# Altium project XVF3000_core_board.PrjPCB
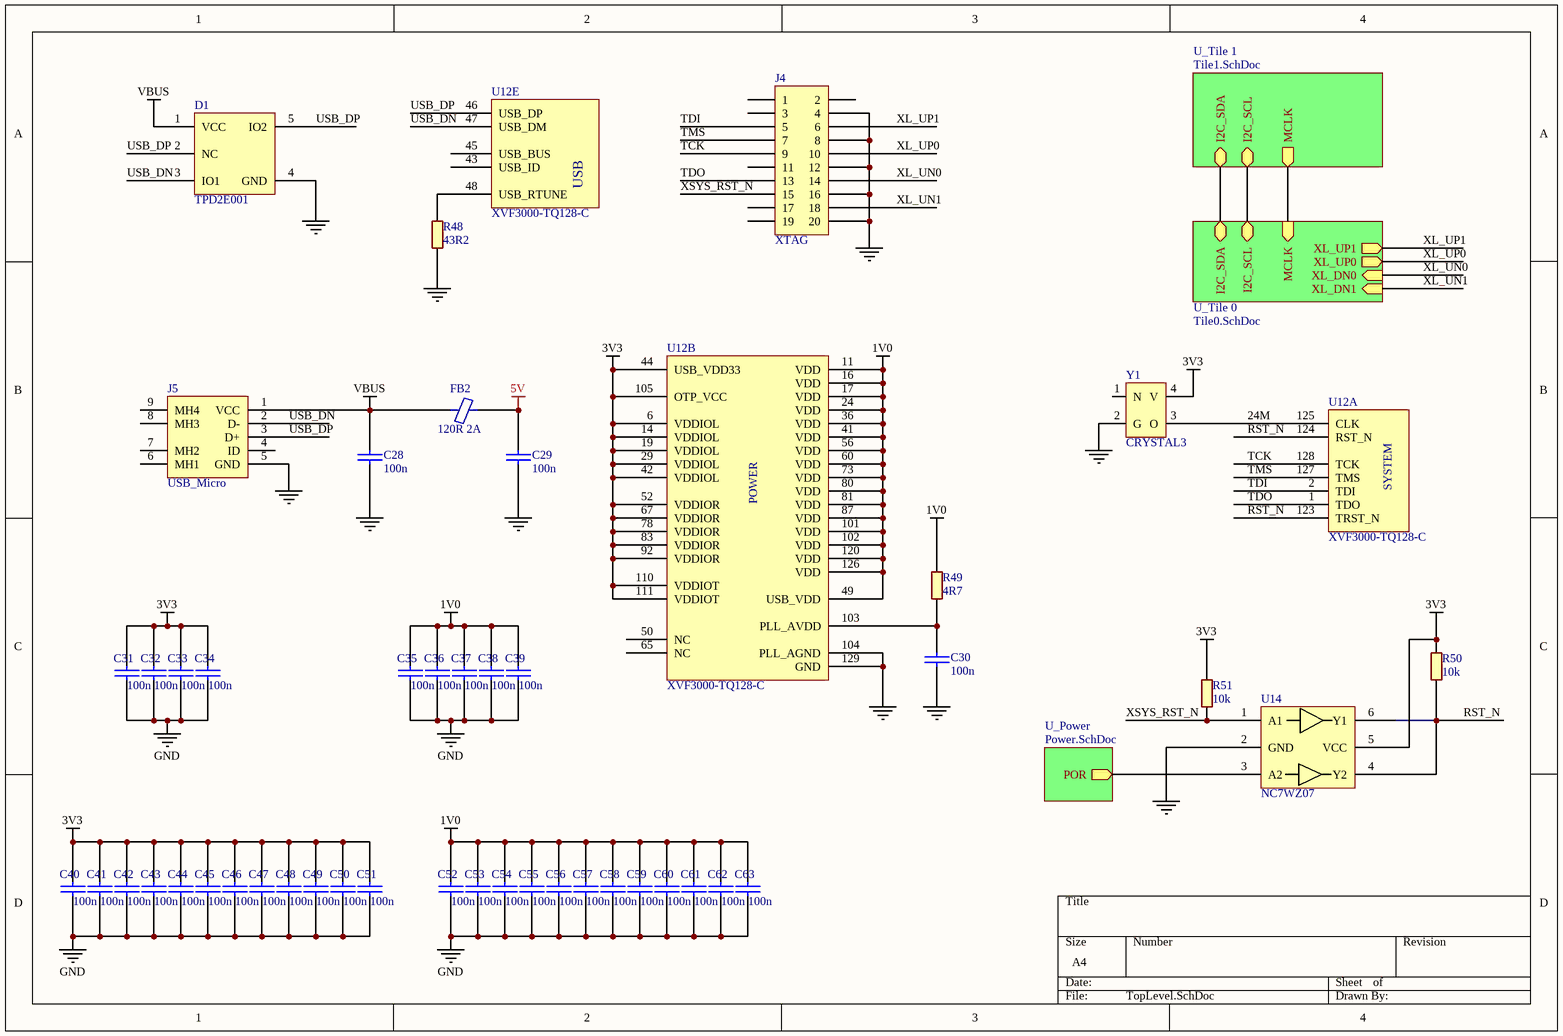
[diagram p0: TopLevel.SchDoc]
5 sheets, 157 parts. Net scope: hierarchical (ports join the sheet entries above them; power ports are global).
Board file: xvf300_core_board.PcbDoc
Sheets:
  TopLevel.SchDoc
    U_Power = Power.SchDoc
    U_Tile 1 = Tile1.SchDoc
    U_Tile 0 = Tile0.SchDoc
      U_Microphones = Microphones.SchDoc

## Sheet TopLevel.SchDoc
size A4

### Parts
C28  100n  [C0603]
C29  100n  [C0603]
C30  100n  [C0603]
C31  100n  [C0603]
C32  100n  [C0603]
C33  100n  [C0603]
C34  100n  [C0603]
C35  100n  [C0603]
C36  100n  [C0603]
C37  100n  [C0603]
C38  100n  [C0603]
C39  100n  [C0603]
C40  100n  [C0603]
C41  100n  [C0603]
C42  100n  [C0603]
C43  100n  [C0603]
C44  100n  [C0603]
C45  100n  [C0603]
C46  100n  [C0603]
C47  100n  [C0603]
C48  100n  [C0603]
C49  100n  [C0603]
C50  100n  [C0603]
C51  100n  [C0603]
C52  100n  [C0603]
C53  100n  [C0603]
C54  100n  [C0603]
C55  100n  [C0603]
C56  100n  [C0603]
C57  100n  [C0603]
C58  100n  [C0603]
C59  100n  [C0603]
C60  100n  [C0603]
C61  100n  [C0603]
C62  100n  [C0603]
C63  100n  [C0603]
D1  TPD2E001  [SOT-5X3]
FB2  120R 2A  [L0603]
J4  XTAG  [MHDR2X10]
J5  USB_Micro  [USB-MICRO5]
R48  43R2  [R0603]
R49  4R7  [R0603]
R50  10k  [R0603]
R51  10k  [R0603]
U12  XVF3000-TQ128-C  [LQFP-128 - VSS]  (parts A,B,E of 5)
U14  NC7WZ07  [SC70-6]
Y1  CRYSTAL3  [JT3225]

### Sub-sheets
U_Power = Power.SchDoc: POR (out)
U_Tile 0 = Tile0.SchDoc: I2C_SDA, I2C_SCL, XL_UP1 (out), XL_UP0 (out), XL_DN0 (in), XL_DN1 (in), MCLK (in)
U_Tile 1 = Tile1.SchDoc: I2C_SDA, I2C_SCL, MCLK (out)

### Nets
1V0: C35.1 C36.1 C37.1 C38.1 C39.1 C52.1 C53.1 C54.1 C55.1 C56.1 C57.1 C58.1 C59.1 C60.1 C61.1 C62.1 C63.1 R49.2 U12.11(VDD) U12.16(VDD) U12.17(VDD) U12.24(VDD) U12.36(VDD) U12.41(VDD) U12.49(USB_VDD) U12.56(VDD) U12.60(VDD) U12.73(VDD) U12.80(VDD) U12.81(VDD) U12.87(VDD) U12.101(VDD) U12.102(VDD) U12.120(VDD) U12.126(VDD)
3V3: C31.1 C32.1 C33.1 C34.1 C40.1 C41.1 C42.1 C43.1 C44.1 C45.1 C46.1 C47.1 C48.1 C49.1 C50.1 C51.1 R50.2 R51.2 U12.6(VDDIOL) U12.14(VDDIOL) U12.19(VDDIOL) U12.29(VDDIOL) U12.42(VDDIOL) U12.44(USB_VDD33) U12.52(VDDIOR) U12.67(VDDIOR) U12.78(VDDIOR) U12.83(VDDIOR) U12.92(VDDIOR) U12.105(OTP_VCC) U12.110(VDDIOT) U12.111(VDDIOT) U14.5(VCC) Y1.4(V)
5V: C29.1 FB2.2
GND: C28.2 C29.2 C30.2 C31.2 C32.2 C33.2 C34.2 C35.2 C36.2 C37.2 C38.2 C39.2 C40.2 C41.2 C42.2 C43.2 C44.2 C45.2 C46.2 C47.2 C48.2 C49.2 C50.2 C51.2 C52.2 C53.2 C54.2 C55.2 C56.2 C57.2 C58.2 C59.2 C60.2 C61.2 C62.2 C63.2 D1.4(GND) J4.4 J4.8 J4.12 J4.16 J4.20 J5.5(GND) R48.1 U12.104(PLL_AGND) U12.129(GND) U14.2(GND) Y1.2(G)
VBUS: C28.1 D1.1(VCC) FB2.1 J5.1(VCC)
24M: U12.125(CLK) Y1.3(O)
I2C_SCL: sheet U_Tile 1/I2C_SCL, sheet U_Tile 0/I2C_SCL
I2C_SDA: sheet U_Tile 1/I2C_SDA, sheet U_Tile 0/I2C_SDA
MCLK_DAC: sheet U_Tile 1/MCLK, sheet U_Tile 0/MCLK
RST_N: R50.1 U12.123(TRST_N) U12.124(RST_N) U14.4(Y2) U14.6(Y1)
TCK: J4.9 U12.128(TCK)
TDI: J4.5 U12.2(TDI)
TDO: J4.13 U12.1(TDO)
TMS: J4.7 U12.127(TMS)
USB_DN: D1.3(IO1) J5.2(D-) U12.47(USB_DM)
USB_DP: D1.2(NC) D1.5(IO2) J5.3(D+) U12.46(USB_DP)
XL_UN0: J4.14 ; sheet U_Tile 0/XL_DN0
XL_UN1: J4.18 ; sheet U_Tile 0/XL_DN1
XL_UP0: J4.10 ; sheet U_Tile 0/XL_UP0
XL_UP1: J4.6 ; sheet U_Tile 0/XL_UP1
XSYS_RST_N: J4.15 R51.1 U14.1(A1)
NetC30_1: C30.1 R49.1 U12.103(PLL_AVDD)
NetQ1_2: U14.3(A2) ; sheet U_Power/POR
NetR48_2: R48.2 U12.48(USB_RTUNE)

Not connected (* = marked no-connect by the designer): J4 1 2 3 11 17 19; J5 4(ID) 6(MH1) 7(MH2) 8(MH3) 9(MH4); U12 43(USB_ID) 45(USB_BUS) 50(NC) 65(NC); Y1 1(N)

### Notes on the sheet
- (in symbol XVF3000-TQ128-C, part A) SYSTEM
- (in symbol XVF3000-TQ128-C, part B) POWER
- (in symbol XVF3000-TQ128-C, part E) USB

### Library data of the parts
C28-C63 = CAP: Capacitor
FB2 = FB
J4 = MHDR2X10: Header, 10-Pin, Dual row; LatestRevisionDate: 17-Jul-2002; LatestRevisionNote: Re-released for DXP Platform.; Publisher: Altium Limited
J5 = USB_Micro_5S_B: USB micro female SMT with 4 fixed foot
R48-R51 = R: RES

## Sheet Power.SchDoc
size A4
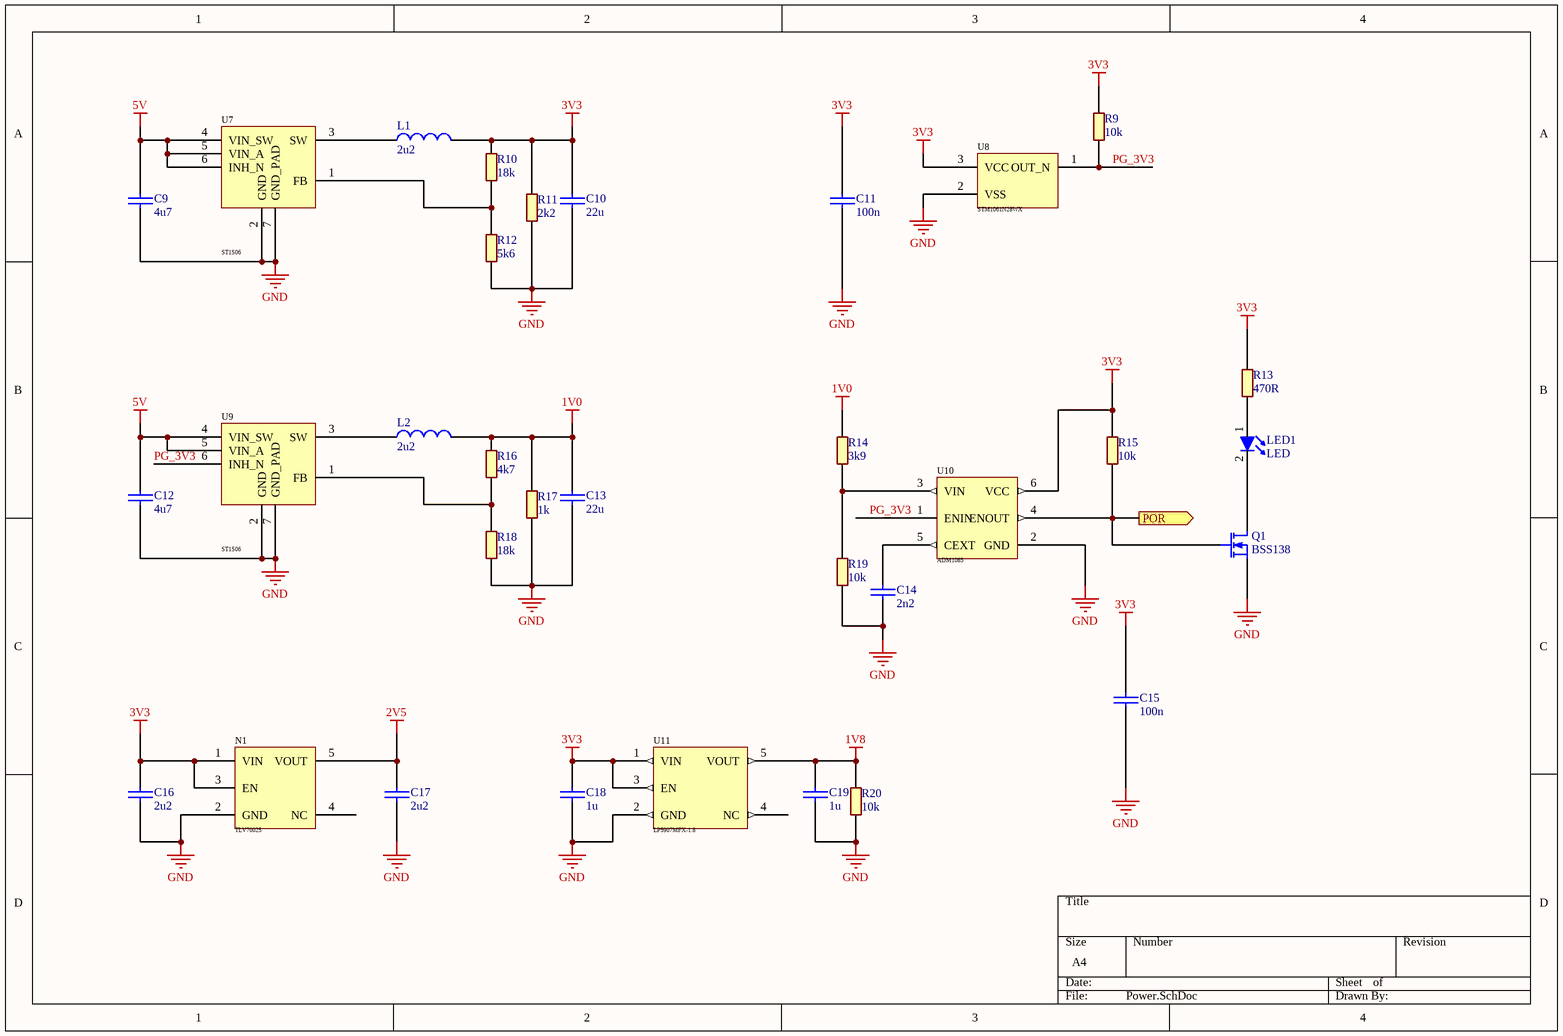
[diagram p1: Power.SchDoc]

### Parts
C9  4u7  [C0805]
C10  22u  [C1206]
C11  100n  [C0603]
C12  4u7  [C0805]
C13  22u  [C1206]
C14  2n2  [C0603]
C15  100n  [C0603]
C16  2u2  [C0805]
C17  2u2  [C0805]
C18  1u  [C0603]
C19  1u  [C0603]
L1  2u2  [L5.8X3.4]
L2  2u2  [L5.8X3.4]
LED1  LED  [LED0603]
N1  TLV70025  [SOT-23-5]
Q1  BSS138  [SOT-23]
R9  10k  [R0603]
R10  18k  [R0603]
R11  2k2  [R0603]
R12  5k6  [R0603]
R13  470R  [R0603]
R14  3k9  [R0603]
R15  10k  [R0603]
R16  4k7  [R0603]
R17  1k  [R0603]
R18  18k  [R0603]
R19  10k  [R0603]
R20  10k  [R0603]
U7  ST1S06
U8  STM1061N28WX  [SOT-23]
U9  ST1S06
U10  ADM1085  [SC70-6]
U11  LP5907MFX-1.8  [LC-SOT-23-5]

### Ports
POR (out)

### Nets
1V0: C13.1 L2.2 R14.1 R16.1 R17.1
1V8: C19.1 R20.1 U11.5(VOUT)
2V5: C17.1 N1.5(VOUT)
3V3: C10.1 C11.1 C15.1 C16.1 C18.1 L1.2 N1.1(VIN) N1.3(EN) R9.1 R10.1 R11.1 R13.1 R15.1 U8.3(VCC) U10.6(VCC) U11.1(VIN) U11.3(EN)
5V: C9.1 C12.1 U7.4(VIN_SW) U7.5(VIN_A) U7.6(INH_N) U9.4(VIN_SW) U9.5(VIN_A)
GND: C9.2 C10.2 C11.2 C12.2 C13.2 C14.2 C15.2 C16.2 C17.2 C18.2 C19.2 N1.2(GND) Q1.3(S) R11.2 R12.1 R17.2 R18.1 R19.2 R20.2 U7.2(GND) U7.7(GND_PAD) U8.2(VSS) U9.2(GND) U9.7(GND_PAD) U10.2(GND) U11.2(GND)
PG_3V3: R9.2 U8.1(OUT_N) U9.6(INH_N) U10.1(ENIN)
NetC14_1: C14.1 U10.5(CEXT)
NetL1_1: L1.1 U7.3(SW)
NetL2_1: L2.1 U9.3(SW)
NetLED1_1: LED1.1 R13.2
NetLED1_2: LED1.2 Q1.1(D)
NetQ1_2: Q1.2(G) R15.2 U10.4(ENOUT) ; port POR
NetR10_2: R10.2 R12.2 U7.1(FB)
NetR14_2: R14.2 R19.1 U10.3(VIN)
NetR16_2: R16.2 R18.2 U9.1(FB)

Not connected (* = marked no-connect by the designer): N1 4(NC); U11 4(NC)

### Library data of the parts
C9-C19 = CAP: Capacitor
L1 L2 = L: Inductor
Q1 = MOSFET-N: N-Channel MOSFET; Published: 8-Jun-2000; LatestRevisionDate: 17-Jul-2002; LatestRevisionNote: Re-released for DXP Platform.; PackageVersion: 1995/1996; PackageReference: E3; Publisher: Altium Limited; PackageDescription: TO, Flat Index; 3 In-Line, Axial Leads; Body Dia. 4.6mm; Lead Dia. 0.5 mm (max)
R9-R20 = R: RES
U7 U9 = ST1S06: The ST1S06xx is a step down DC-DC converter  optimized for powering low-voltage digital core in  HDD applications and, generally, to replace the  high current linear solution when the power  dissipation may cause an high heating of the  application environment. It provides up to 1.5 A  over an input voltage range of 2.7 V to 6 V. An high  switching frequency (1.5 MHz) allows the use of  tiny surface-mount components: as well as the  resistor divider to set the output voltage value,  only an inductor and two capacitors are required

## Sheet Tile1.SchDoc
size A4
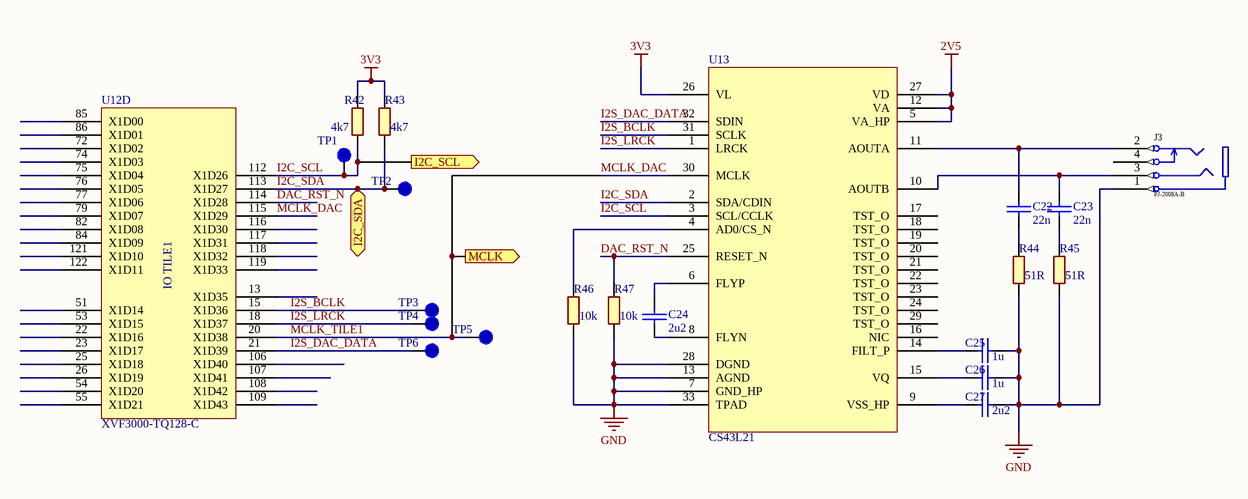
[diagram p2: Tile1.SchDoc]

### Parts
C22  22n  [C0603]
C23  22n  [C0603]
C24  2u2  [C0603]
C25  1u  [C0603]
C26  1u  [C0603]
C27  2u2  [C0603]
J3  PJ-2008A-B  [PJ-2008A-B]
R42  4k7  [R0603]
R43  4k7  [R0603]
R44  51R  [R0603]
R45  51R  [R0603]
R46  10k  [R0603]
R47  10k  [R0603]
TP1  TP  [TP1]  (value not drawn)
TP2  TP  [TP1]  (value not drawn)
TP3  TP  [TP1]  (value not drawn)
TP4  TP  [TP1]  (value not drawn)
TP5  TP  [TP1]  (value not drawn)
TP6  TP  [TP1]  (value not drawn)
U12  XVF3000-TQ128-C  [LQFP-128 - VSS]  (part D of 5)
U13  CS43L21  [QFN-32]

### Ports
I2C_SCL (out), I2C_SDA (bidir), MCLK (out)

### Nets
2V5: U13.5(VA_HP) U13.12(VA) U13.27(VD)
3V3: R42.2 R43.2 U13.26(VL)
GND: C25.2 C26.2 C27.2 J3.1 R44.1 R45.1 R46.1 R47.1 U13.7(GND_HP) U13.13(AGND) U13.28(DGND) U13.33(TPAD)
DAC_RST_N: R47.2 U12.114(X1D28) U13.25(RESET_N)
I2C_SCL: R42.1 TP1.1 U12.112(X1D26) U13.3(SCL/CCLK) ; port I2C_SCL
I2C_SDA: R43.1 TP2.1 U12.113(X1D27) U13.2(SDA/CDIN) ; port I2C_SDA
I2S_BCLK: TP3.1 U12.15(X1D36) U13.31(SCLK)
I2S_DAC_DATA: TP6.1 U12.21(X1D39) U13.32(SDIN)
I2S_LRCK: TP4.1 U12.18(X1D37) U13.1(LRCK)
MCLK_DAC: TP5.1 U12.20(X1D38) U12.115(X1D29) U13.30(MCLK) ; port MCLK  [also labelled MCLK_TILE1]
NetC22_1: C22.1 R44.2
NetC22_2: C22.2 J3.2 U13.11(AOUTA)
NetC23_1: C23.1 R45.2
NetC23_2: C23.2 J3.3 U13.10(AOUTB)
NetC24_1: C24.1 U13.6(FLYP)
NetC24_2: C24.2 U13.8(FLYN)
NetC25_1: C25.1 U13.14(FILT_P)
NetC26_1: C26.1 U13.15(VQ)
NetC27_1: C27.1 U13.9(VSS_HP)
NetR46_2: R46.2 U13.4(AD0/CS_N)

Not connected (* = marked no-connect by the designer): J3 4; U12 13(X1D35) 22(X1D16) 23(X1D17) 25(X1D18) 26(X1D19) 51(X1D14) 53(X1D15) 54(X1D20) 55(X1D21) 72(X1D02) 74(X1D03) 75(X1D04) 76(X1D05) 77(X1D06) 79(X1D07) 82(X1D08) 84(X1D09) 85(X1D00) 86(X1D01) 106(X1D40) 107(X1D41) 108(X1D42) 109(X1D43) 116(X1D30) 117(X1D31) 118(X1D32) 119(X1D33) 121(X1D10) 122(X1D11); U13 16(NIC) 17(TST_O) 18(TST_O) 19(TST_O) 20(TST_O) 21(TST_O) 22(TST_O) 23(TST_O) 24(TST_O) 29(TST_O)

### Notes on the sheet
- (in symbol XVF3000-TQ128-C, part D) IO TILE1

### Library data of the parts
C22-C27 = CAP: Capacitor
R42-R47 = R: RES

## Sheet Tile0.SchDoc
size A4
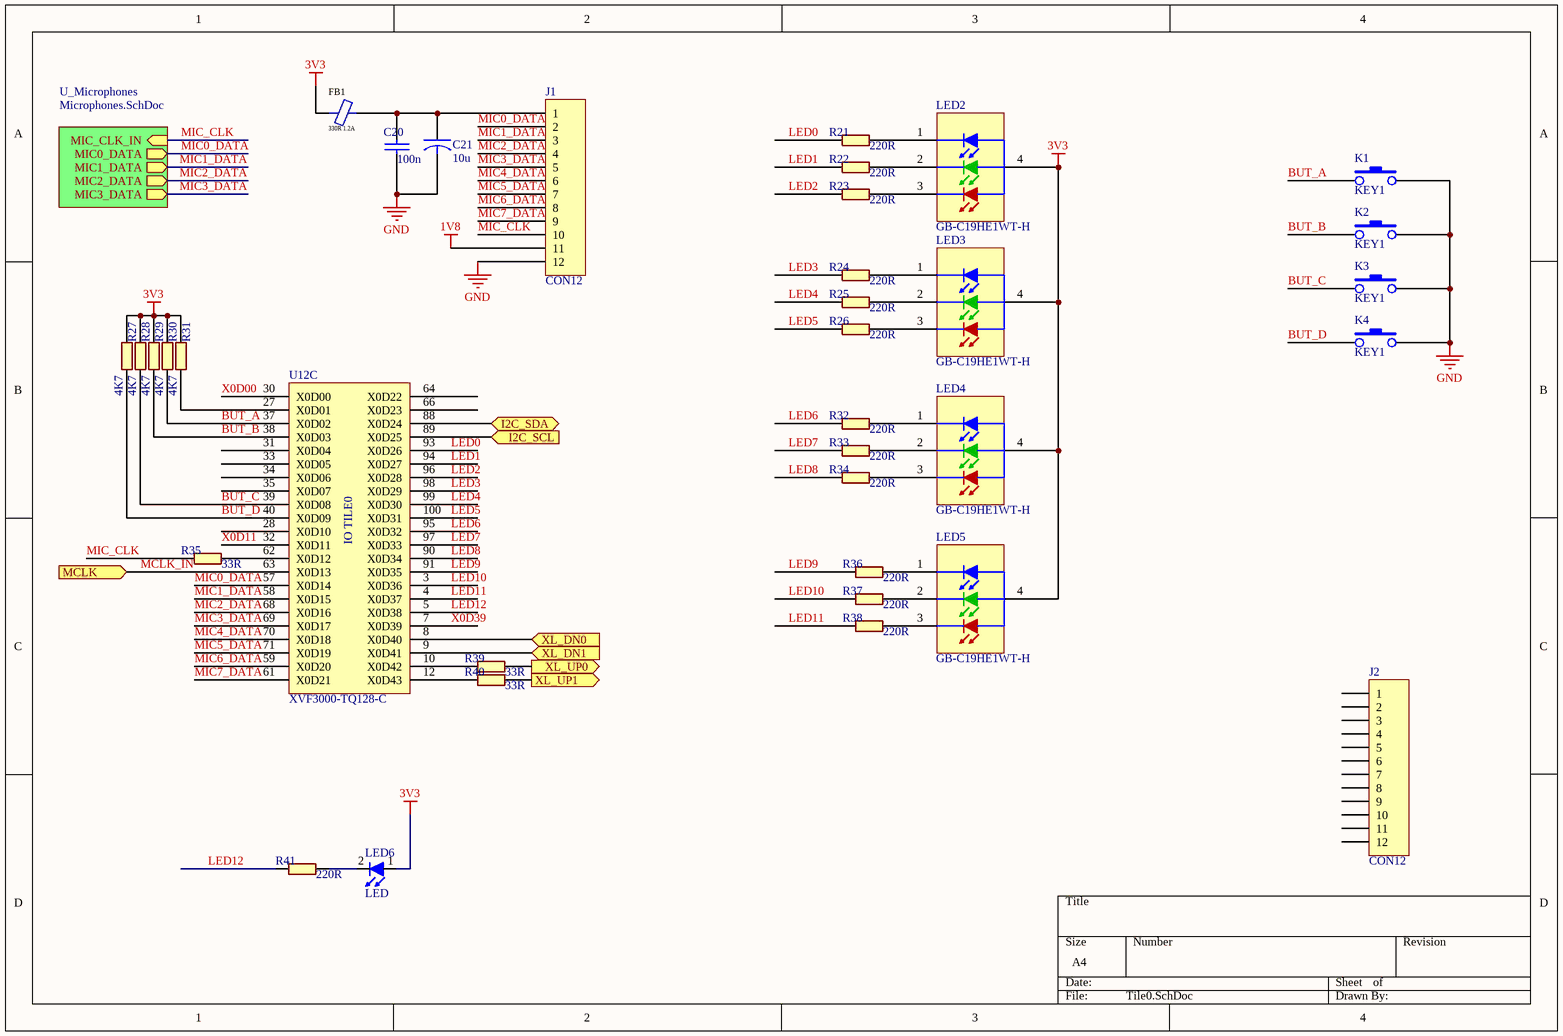
[diagram p3: Tile0.SchDoc]

### Parts
C20  100n  [C0603]
C21  10u  [C1206]
FB1  330R 1.2A  [L0603]
J1  CON12  [FFC/SM0.5-2H12A]
J2  CON12  [FFC/SM0.5-2H12A]
K1  KEY1  [BUTTON6]
K2  KEY1  [BUTTON6]
K3  KEY1  [BUTTON6]
K4  KEY1  [BUTTON6]
LED2  GB-C19HE1WT-H  [LED1615]
LED3  GB-C19HE1WT-H  [LED1615]
LED4  GB-C19HE1WT-H  [LED1615]
LED5  GB-C19HE1WT-H  [LED1615]
LED6  LED  [LED0805]
R21  220R  [R0603]
R22  220R  [R0603]
R23  220R  [R0603]
R24  220R  [R0603]
R25  220R  [R0603]
R26  220R  [R0603]
R27  4K7  [R0603]
R28  4K7  [R0603]
R29  4K7  [R0603]
R30  4K7  [R0603]
R31  4K7  [R0603]
R32  220R  [R0603]
R33  220R  [R0603]
R34  220R  [R0603]
R35  33R  [R0603]
R36  220R  [R0603]
R37  220R  [R0603]
R38  220R  [R0603]
R39  33R  [R0603]
R40  33R  [R0603]
R41  220R  [R0603]
U12  XVF3000-TQ128-C  [LQFP-128 - VSS]  (part C of 5)

### Sub-sheets
U_Microphones = Microphones.SchDoc: MIC_CLK_IN (in), MIC0_DATA (out), MIC1_DATA (out), MIC2_DATA (out), MIC3_DATA (out)

### Ports
I2C_SCL (in), I2C_SDA (bidir), MCLK (in), XL_DN0 (in), XL_DN1 (in), XL_UP0 (out), XL_UP1 (out)

### Nets
1V8: J1.11
3V3: FB1.2 LED2.4 LED3.4 LED4.4 LED5.4 LED6.1 R27.2 R28.2 R29.2 R30.2 R31.2
GND: C20.2 C21.2 J1.12 K1.2 K2.2 K3.2 K4.2
BUT_A: K1.1 R30.1 U12.37(X0D02)
BUT_B: K2.1 R29.1 U12.38(X0D03)
BUT_C: K3.1 R28.1 U12.39(X0D08)
BUT_D: K4.1 R27.1 U12.40(X0D09)
I2C_SCL: U12.89(X0D25) ; port I2C_SCL
I2C_SDA: U12.88(X0D24) ; port I2C_SDA
LED0: R21.2 U12.93(X0D26)
LED1: R22.2 U12.94(X0D27)
LED2: R23.2 U12.96(X0D28)
LED3: R24.2 U12.98(X0D29)
LED4: R25.2 U12.99(X0D30)
LED5: R26.2 U12.100(X0D31)
LED6: R32.2 U12.95(X0D32)
LED7: R33.2 U12.97(X0D33)
LED8: R34.2 U12.90(X0D34)
LED9: R36.2 U12.91(X0D35)
LED10: R37.2 U12.3(X0D36)
LED11: R38.2 U12.4(X0D37)
LED12: R41.2 U12.5(X0D38)
MCLK_IN: U12.63(X0D13) ; port MCLK  [project net MCLK_DAC]
MIC0_DATA: J1.2 U12.57(X0D14) ; sheet U_Microphones/MIC0_DATA
MIC1_DATA: J1.3 U12.58(X0D15) ; sheet U_Microphones/MIC1_DATA
MIC2_DATA: J1.4 U12.68(X0D16) ; sheet U_Microphones/MIC2_DATA
MIC3_DATA: J1.5 U12.69(X0D17) ; sheet U_Microphones/MIC3_DATA
MIC4_DATA: J1.6 U12.70(X0D18)
MIC5_DATA: J1.7 U12.71(X0D19)
MIC6_DATA: J1.8 U12.59(X0D20)
MIC7_DATA: J1.9 U12.61(X0D21)
MIC_CLK: J1.10 R35.2 ; sheet U_Microphones/MIC_CLK_IN
X0D00: U12.30(X0D00)
X0D11: U12.32(X0D11)
X0D39: U12.7(X0D39)
XL_UN0: U12.8(X0D40) ; port XL_DN0
XL_UN1: U12.9(X0D41) ; port XL_DN1
XL_UP0: R39.1 ; port XL_UP0
XL_UP1: R40.1 ; port XL_UP1
NetC20_1: C20.1 C21.1 FB1.1 J1.1
NetLED2_1: LED2.1 R21.1
NetLED2_2: LED2.2 R22.1
NetLED2_3: LED2.3 R23.1
NetLED3_1: LED3.1 R24.1
NetLED3_2: LED3.2 R25.1
NetLED3_3: LED3.3 R26.1
NetLED4_1: LED4.1 R32.1
NetLED4_2: LED4.2 R33.1
NetLED4_3: LED4.3 R34.1
NetLED5_1: LED5.1 R36.1
NetLED5_2: LED5.2 R37.1
NetLED5_3: LED5.3 R38.1
NetLED6_2: LED6.2 R41.1
NetR31_1: R31.1 U12.27(X0D01)
NetR35_1: R35.1 U12.62(X0D12)
NetR39_2: R39.2 U12.10(X0D42)
NetR40_2: R40.2 U12.12(X0D43)

Not connected (* = marked no-connect by the designer): J2 1 2 3 4 5 6 7 8 9 10 11 12; U12 28(X0D10) 31(X0D04) 33(X0D05) 34(X0D06) 35(X0D07) 64(X0D22) 66(X0D23)

### Notes on the sheet
- (in symbol XVF3000-TQ128-C, part C) IO TILE0

### Library data of the parts
C20 = CAP: Capacitor
C21 = CAPACITOR
FB1 = FB
J1 J2 = CON12: Connector
K1-K4 = BUTTON
LED2-LED5 = LED-1615: LED RGB
R21-R41 = R: RES

## Sheet Microphones.SchDoc
size A4
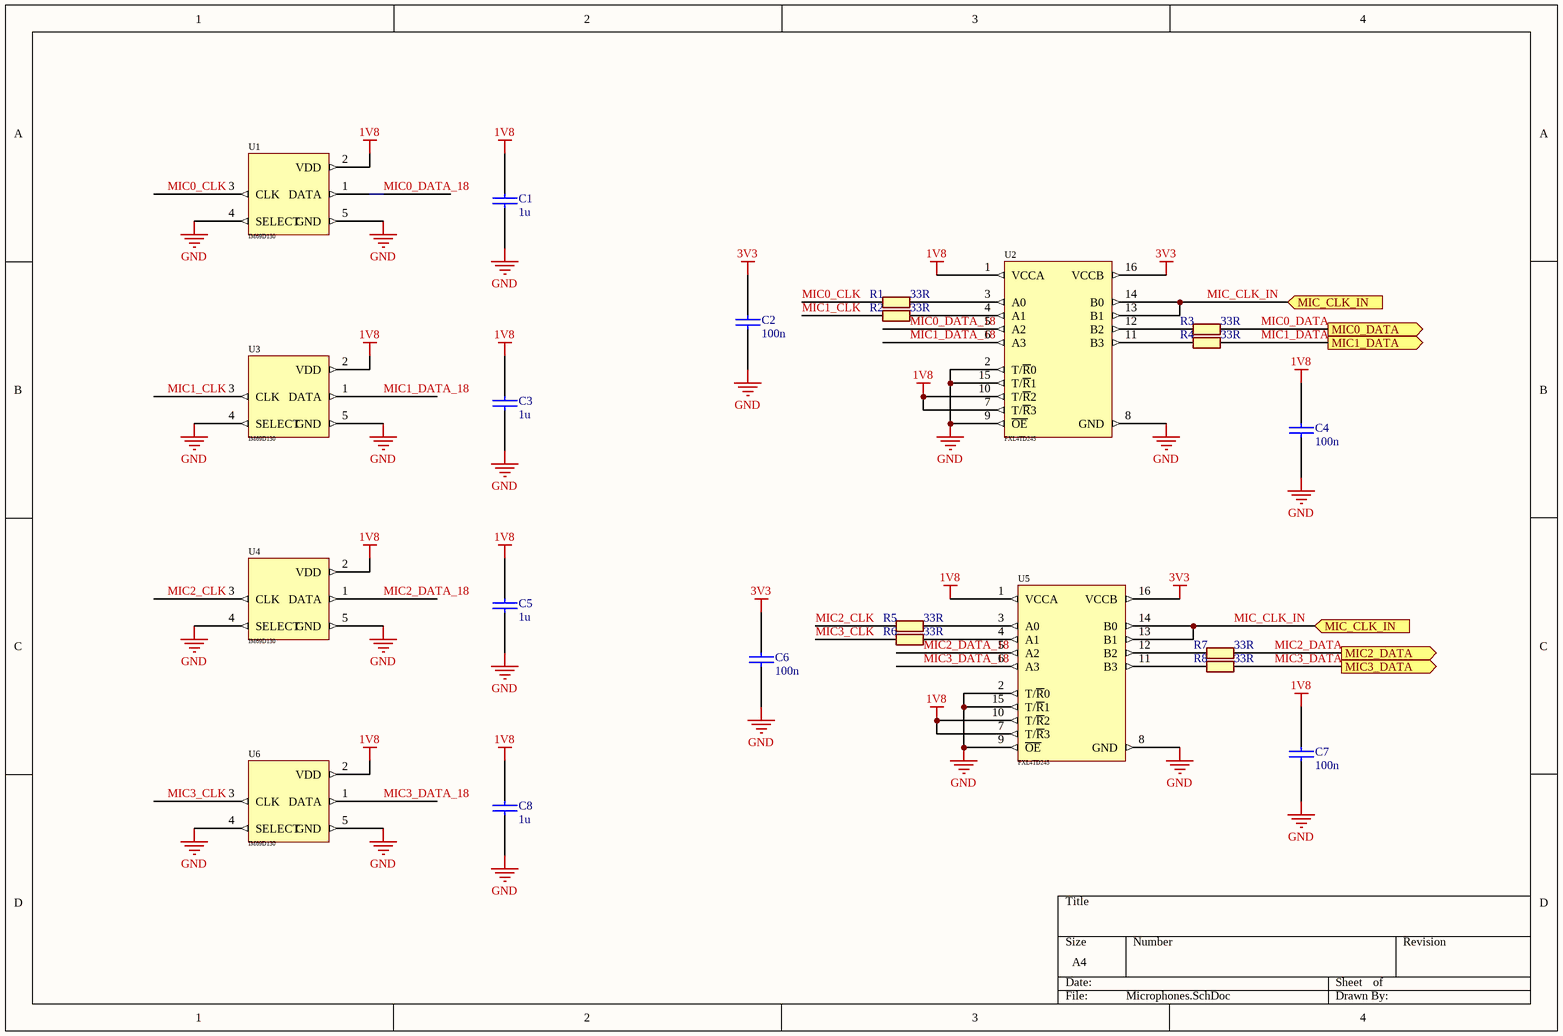
[diagram p4: Microphones.SchDoc]

### Parts
C1  1u  [C0603]
C2  100n  [C0603]
C3  1u  [C0603]
C4  100n  [C0603]
C5  1u  [C0603]
C6  100n  [C0603]
C7  100n  [C0603]
C8  1u  [C0603]
R1  33R  [R0603]
R2  33R  [R0603]
R3  33R  [R0603]
R4  33R  [R0603]
R5  33R  [R0603]
R6  33R  [R0603]
R7  33R  [R0603]
R8  33R  [R0603]
U1  IM69D130  [IM69D130 - duplicate]
U2  FXL4TD245  [DQFN16]
U3  IM69D130  [IM69D130 - duplicate]
U4  IM69D130  [IM69D130 - duplicate]
U5  FXL4TD245  [DQFN16]
U6  IM69D130  [IM69D130 - duplicate]

### Ports
MIC0_DATA (out), MIC1_DATA (out), MIC2_DATA (out), MIC3_DATA (out), MIC_CLK_IN (in)

### Nets
1V8: C1.1 C3.1 C4.1 C5.1 C7.1 C8.1 U1.2(VDD) U2.1(VCCA) U2.7(T/~{R}3) U2.10(T/~{R}2) U3.2(VDD) U4.2(VDD) U5.1(VCCA) U5.7(T/~{R}3) U5.10(T/~{R}2) U6.2(VDD)
3V3: C2.1 C6.1 U2.16(VCCB) U5.16(VCCB)
GND: C1.2 C2.2 C3.2 C4.2 C5.2 C6.2 C7.2 C8.2 U1.4(SELECT) U1.5(GND) U2.2(T/~{R}0) U2.8(GND) U2.9(~{OE}) U2.15(T/~{R}1) U3.4(SELECT) U3.5(GND) U4.4(SELECT) U4.5(GND) U5.2(T/~{R}0) U5.8(GND) U5.9(~{OE}) U5.15(T/~{R}1) U6.4(SELECT) U6.5(GND)
MIC0_CLK: R1.1 U1.3(CLK)
MIC0_DATA: R3.2 ; port MIC0_DATA
MIC0_DATA_18: U1.1(DATA) U2.5(A2)
MIC1_CLK: R2.1 U3.3(CLK)
MIC1_DATA: R4.2 ; port MIC1_DATA
MIC1_DATA_18: U2.6(A3) U3.1(DATA)
MIC2_CLK: R5.1 U4.3(CLK)
MIC2_DATA: R7.2 ; port MIC2_DATA
MIC2_DATA_18: U4.1(DATA) U5.5(A2)
MIC3_CLK: R6.1 U6.3(CLK)
MIC3_DATA: R8.2 ; port MIC3_DATA
MIC3_DATA_18: U5.6(A3) U6.1(DATA)
MIC_CLK_IN: U2.13(B1) U2.14(B0) U5.13(B1) U5.14(B0) ; port MIC_CLK_IN  [project net MIC_CLK]
NetR1_2: R1.2 U2.3(A0)
NetR2_2: R2.2 U2.4(A1)
NetR3_1: R3.1 U2.12(B2)
NetR4_1: R4.1 U2.11(B3)
NetR5_2: R5.2 U5.3(A0)
NetR6_2: R6.2 U5.4(A1)
NetR7_1: R7.1 U5.12(B2)
NetR8_1: R8.1 U5.11(B3)

### Library data of the parts
C1-C8 = CAP: Capacitor
R1-R8 = R: RES

## Nets that join several sheets
1V0: TopLevel (35 pins), Power (5 pins)
1V8: Power (C19.1 R20.1 U11.5), Tile0 (J1.11), Microphones (16 pins)
2V5: Power (C17.1 N1.5), Tile1 (U13.5 U13.12 U13.27)
3V3: TopLevel (34 pins), Power (17 pins), Tile1 (R42.2 R43.2 U13.26), Tile0 (11 pins), Microphones (C2.1 C6.1 U2.16 U5.16)
5V: TopLevel (C29.1 FB2.2), Power (7 pins)
GND: TopLevel (48 pins), Power (26 pins), Tile1 (12 pins), Tile0 (7 pins), Microphones (24 pins)
I2C_SCL: Tile1 (R42.1 TP1.1 U12.112 U13.3), Tile0 (U12.89)
I2C_SDA: Tile1 (R43.1 TP2.1 U12.113 U13.2), Tile0 (U12.88)
MCLK_DAC: Tile1 (TP5.1 U12.20 U12.115 U13.30), Tile0 (U12.63)
MIC0_DATA: Tile0 (J1.2 U12.57), Microphones (R3.2)
MIC1_DATA: Tile0 (J1.3 U12.58), Microphones (R4.2)
MIC2_DATA: Tile0 (J1.4 U12.68), Microphones (R7.2)
MIC3_DATA: Tile0 (J1.5 U12.69), Microphones (R8.2)
MIC_CLK: Tile0 (J1.10 R35.2), Microphones (U2.13 U2.14 U5.13 U5.14)
NetQ1_2: TopLevel (U14.3), Power (Q1.2 R15.2 U10.4)
XL_UN0: TopLevel (J4.14), Tile0 (U12.8)
XL_UN1: TopLevel (J4.18), Tile0 (U12.9)
XL_UP0: TopLevel (J4.10), Tile0 (R39.1)
XL_UP1: TopLevel (J4.6), Tile0 (R40.1)